# EAGLE schematic glove_final (EAGLE 7.1.0)
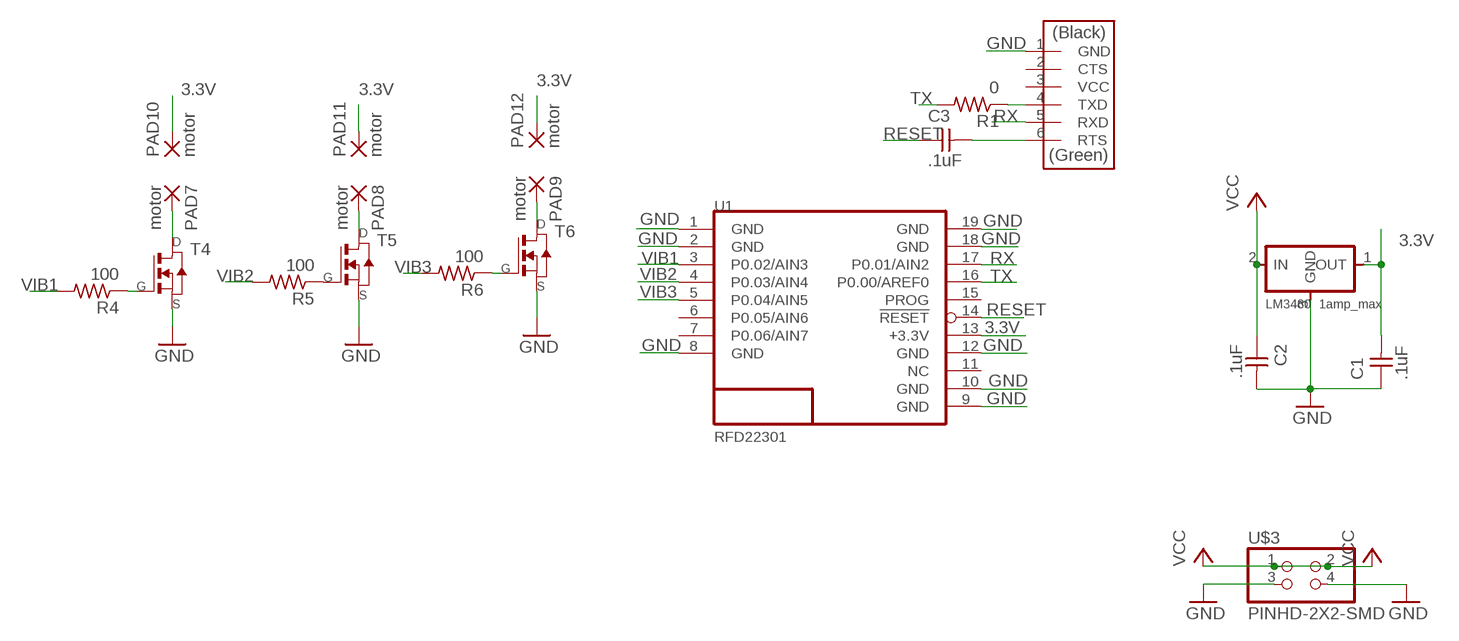
[diagram p0: schematic, sheet 1]

## Parts
C1  .1uF  CAP-UNPOLARIZEDFAB  [C1206FAB]
C2  .1uF  CAP-UNPOLARIZEDFAB  [C1206FAB]
C3  .1uF  CAP-UNPOLARIZEDFAB  [C1206FAB]
LM3480  1amp_max  REGULATORSOT23  [SOT23]
PAD7  motor  WIREPADSMD1,27-254  [SMD1,27-2,54]
PAD8  motor  WIREPADSMD1,27-254  [SMD1,27-2,54]
PAD9  motor  WIREPADSMD1,27-254  [SMD1,27-2,54]
PAD10  motor  WIREPADSMD1,27-254  [SMD1,27-2,54]
PAD11  motor  WIREPADSMD1,27-254  [SMD1,27-2,54]
PAD12  motor  WIREPADSMD1,27-254  [SMD1,27-2,54]
R1  0  RES-US1206FAB  [R1206FAB]
R4  100  RES-US1206FAB  [R1206FAB]
R5  100  RES-US1206FAB  [R1206FAB]
R6  100  RES-US1206FAB  [R1206FAB]
T4  NMOSFETSOT23  [SOT-23]
T5  NMOSFETSOT23  [SOT-23]
T6  NMOSFETSOT23  [SOT-23]
U1  RFD22301  [RFD22301]
U$1  FTDI-SMD-HEADER  [1X06SMD]
U$3  PINHD-2X2-SMD  [2X02SMD]

## Nets
3.3V: C1.2 LM3480.1(OUT) PAD10.1(P) PAD11.1(P) PAD12.1(P) U1.13(+3.3V)
GND: C1.1 C2.2 LM3480.3(GND) T4.2(S) T5.2(S) T6.2(S) U1.1(GND) U1.2(GND) U1.8(GND) U1.9(GND) U1.10(GND) U1.12(GND) U1.18(GND) U1.19(GND) U$1.1(GND) U$3.3 U$3.4
N$1: C3.2 U$1.6(RTS)
N$2: R1.1 U$1.4(TXD)
N$5: PAD7.1(P) T4.1(D)
N$6: PAD8.1(P) T5.1(D)
N$7: PAD9.1(P) T6.1(D)
N$8: R5.1 T5.3(G)
N$9: R4.1 T4.3(G)
N$10: R6.1 T6.3(G)
RESET: C3.1 U1.14(!RESET)
RX: U1.17(P0.01/AIN2) U$1.5(RXD)
TX: R1.2 U1.16(P0.00/AREF0)
VCC: C2.1 LM3480.2(IN) U$3.1 U$3.2
VIB1: R4.2 U1.3(P0.02/AIN3)
VIB2: R5.2 U1.4(P0.03/AIN4)
VIB3: R6.2 U1.5(P0.04/AIN5)
Unconnected: U1.6(P0.05/AIN6) U1.7(P0.06/AIN7) U1.11(NC) U1.15(PROG) U$1.2(CTS) U$1.3(VCC)

## Library data of the parts
C1-C3 = fab_copy:CAP-UNPOLARIZED
LM3480 = fab_copy:REGULATOR
PAD7-PAD12 = wirepad:WIREPAD: Wire PAD connect wire on PCB
R1 R4-R6 = fab_copy:RES-US: Resistor (US Symbol) Variants with postfix FAB are widened to allow the routing of internal traces
T4-T6 = fab_copy:NMOSFET: MOS FET
U1 = Ai_RF:RFD22301: RF Digital RFD22301
U$1 = fab_copy:FTDI-SMD-HEADER
U$3 = fab_copy:PINHD-2X2-SMD